# EAGLE schematic lpc1788_board (EAGLE 6.6.0)

## Sheet 1 of 4: LPC1788
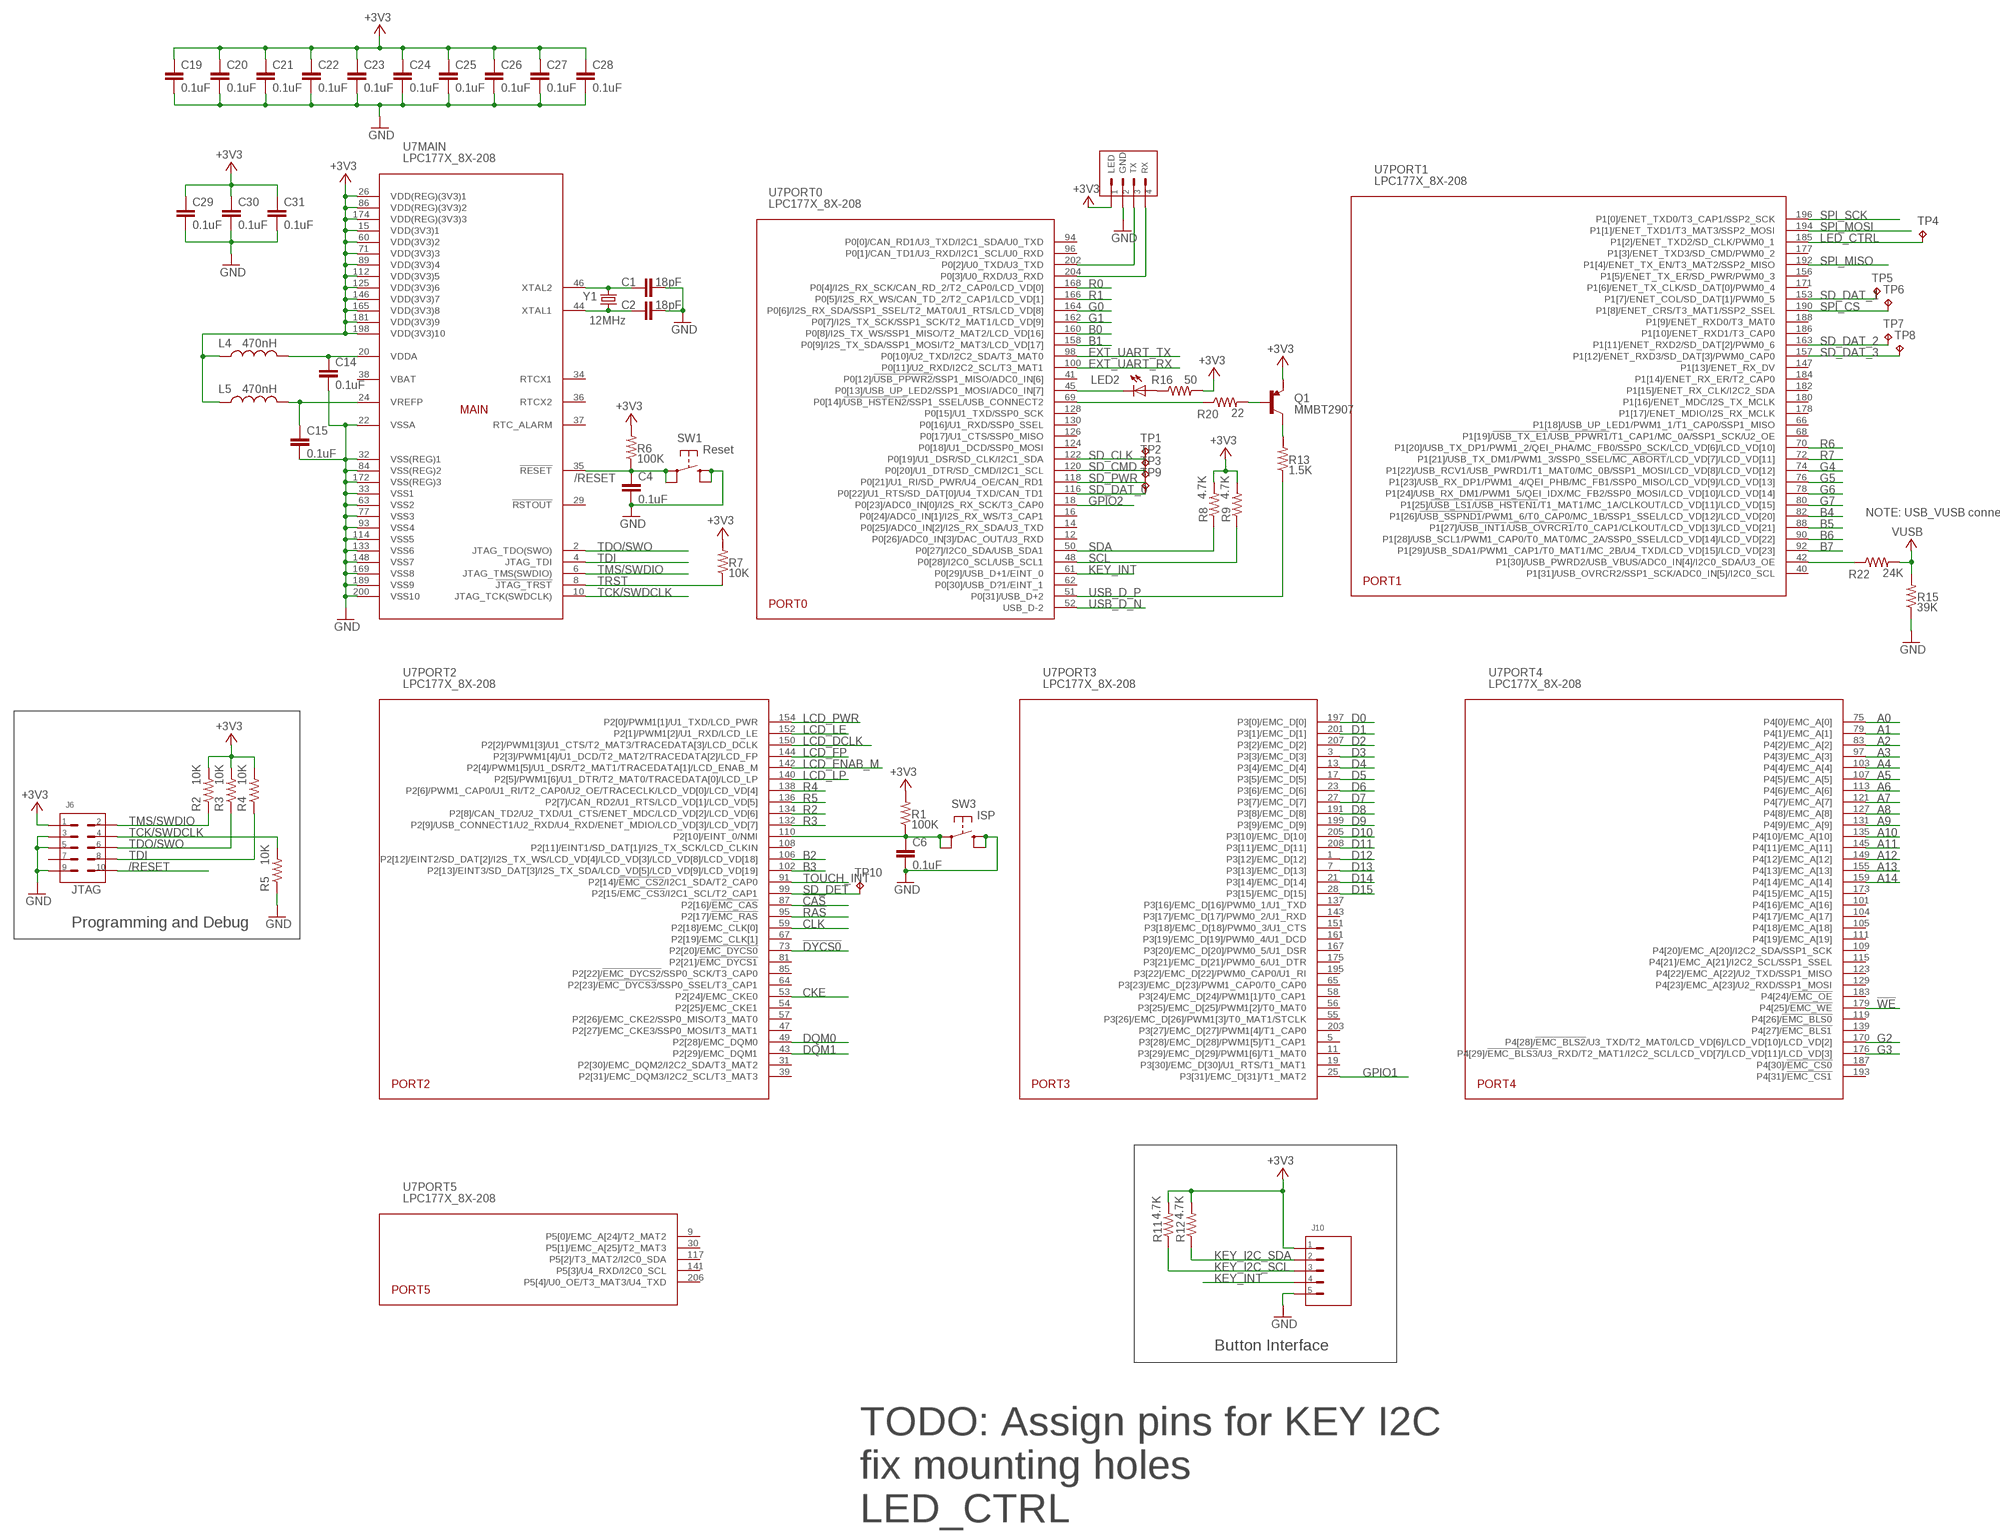
[diagram p0: schematic, sheet 1, part 1 of 2]
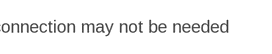
[diagram p1: schematic, sheet 1, part 2 of 2]

### Parts
C1  18pF  C-EUC0402  [C0402]
C2  18pF  C-EUC0402  [C0402]
C4  0.1uF  C-EUC0402  [C0402]
C6  0.1uF  C-EUC0402  [C0402]
C14  0.1uF  C-EUC0402  [C0402]
C15  0.1uF  C-EUC0402  [C0402]
C19  0.1uF  C-EUC0402  [C0402]
C20  0.1uF  C-EUC0402  [C0402]
C21  0.1uF  C-EUC0402  [C0402]
C22  0.1uF  C-EUC0402  [C0402]
C23  0.1uF  C-EUC0402  [C0402]
C24  0.1uF  C-EUC0402  [C0402]
C25  0.1uF  C-EUC0402  [C0402]
C26  0.1uF  C-EUC0402  [C0402]
C27  0.1uF  C-EUC0402  [C0402]
C28  0.1uF  C-EUC0402  [C0402]
C29  0.1uF  C-EUC0402  [C0402]
C30  0.1uF  C-EUC0402  [C0402]
C31  0.1uF  C-EUC0402  [C0402]
J4  Console  FLEX_SERIAL_HEADER  [4-PIN_1.25MM]
J6  JTAG  10PIN_5X2_.050IN  [10-PIN_5X2_.050IN_SMT]
J10  MOLEX_527930570_5PIN_FFC_CONNECTOR  [MOLEX_527930570]
L4  470nH  INDUCTOR_0603  [0603]
L5  470nH  INDUCTOR_0603  [0603]
LED2  USB  LEDCHIPLED_0603  [CHIPLED_0603]
Q1  MMBT2907  TRANSISTOR_PNPMMBT4403  [SOT23]
R1  100K  R-US_R0402  [R0402]
R2  10K  R-US_R0402  [R0402]
R3  10K  R-US_R0402  [R0402]
R4  10K  R-US_R0402  [R0402]
R5  10K  R-US_R0402  [R0402]
R6  100K  R-US_R0402  [R0402]
R7  10K  R-US_R0402  [R0402]
R8  4.7K  R-US_R0402  [R0402]
R9  4.7K  R-US_R0402  [R0402]
R11  4.7K  R-US_R0402  [R0402]
R12  4.7K  R-US_R0402  [R0402]
R13  1.5K  R-US_R0402  [R0402]
R15  39K  R-US_R0402  [R0402]
R16  50  R-US_R0402  [R0402]
R20  22  R-US_R0402  [R0402]
R22  24K  R-US_R0402  [R0402]
SW1  Reset  SMT_PUSHBUTTON  [SMT_PUSHBUTTON]
SW3  ISP  SMT_PUSHBUTTON  [SMT_PUSHBUTTON]
TP1  TPTP10R  [TP10R]
TP2  TPTP10R  [TP10R]
TP3  TPTP10R  [TP10R]
TP4  TPTP10R  [TP10R]
TP5  TPTP10R  [TP10R]
TP6  TPTP10R  [TP10R]
TP7  TPTP10R  [TP10R]
TP8  TPTP10R  [TP10R]
TP9  TPTP10R  [TP10R]
TP10  TPTP10R  [TP10R]
U7  LPC177X_8X-208  [LQFP208]
Y1  12MHz  XTAL_2SMD_8MMX4.5MM12MHZ  [2-SMD_8MMX4.5MM]

### Nets
!CAS: U7.87(PORT2:P2[16]/!EMC_CAS!) ; also sheet 4
!DYCS0: U7.73(PORT2:P2[20]/!EMC_DYCS0!) ; also sheet 4
!RAS: U7.95(PORT2:P2[17]/!EMC_RAS!) ; also sheet 4
!WE: U7.179(PORT4:P4[25]/!EMC_WE!) ; also sheet 4
+3V3: C19.1 C20.1 C21.1 C22.1 C23.1 C24.1 C25.1 C26.1 C27.1 C28.1 C29.1 C30.1 C31.1 J4.1(S1) J6.P$1(S1) J10.P$1(S1) L4.1 L5.1 Q1.2(E) R1.2 R2.2 R3.2 R4.2 R6.2 R7.2 R8.2 R9.2 R11.2 R12.2 R16.2 U7.15(MAIN:VDD(3V3)1) U7.26(MAIN:VDD(REG)(3V3)1) U7.60(MAIN:VDD(3V3)2) U7.71(MAIN:VDD(3V3)3) U7.86(MAIN:VDD(REG)(3V3)2) U7.89(MAIN:VDD(3V3)4) U7.112(MAIN:VDD(3V3)5) U7.125(MAIN:VDD(3V3)6) U7.146(MAIN:VDD(3V3)7) U7.165(MAIN:VDD(3V3)8) U7.174(MAIN:VDD(REG)(3V3)3) U7.181(MAIN:VDD(3V3)9) U7.198(MAIN:VDD(3V3)10) ; also sheet 2,3,4
+VUSB: R15.2 R22.2 ; supply symbol labelled VUSB ; also sheet 2
/RESET: C4.1 J6.P$10(S10) R6.1 SW1.P$1(P1) SW1.P$2(P) U7.35(MAIN:!RESET!)
/RESET1: C6.1 R1.1 SW3.P$1(P1) SW3.P$2(P) U7.110(PORT2:P2[10]/EINT_0/NMI)
A0: U7.75(PORT4:P4[0]/EMC_A[0]) ; also sheet 4
A1: U7.79(PORT4:P4[1]/EMC_A[1]) ; also sheet 4
A2: U7.83(PORT4:P4[2]/EMC_A[2]) ; also sheet 4
A3: U7.97(PORT4:P4[3]/EMC_A[3]) ; also sheet 4
A4: U7.103(PORT4:P4[4]/EMC_A[4]) ; also sheet 4
A5: U7.107(PORT4:P4[5]/EMC_A[5]) ; also sheet 4
A6: U7.113(PORT4:P4[6]/EMC_A[6]) ; also sheet 4
A7: U7.121(PORT4:P4[7]/EMC_A[7]) ; also sheet 4
A8: U7.127(PORT4:P4[8]/EMC_A[8]) ; also sheet 4
A9: U7.131(PORT4:P4[9]/EMC_A[9]) ; also sheet 4
A10: U7.135(PORT4:P4[10]/EMC_A[10]) ; also sheet 4
A11: U7.145(PORT4:P4[11]/EMC_A[11]) ; also sheet 4
A12: U7.149(PORT4:P4[12]/EMC_A[12]) ; also sheet 4
A13: U7.155(PORT4:P4[13]/EMC_A[13]) ; also sheet 4
A14: U7.159(PORT4:P4[14]/EMC_A[14]) ; also sheet 4
B0: U7.160(PORT0:P0[8]/I2S_TX_WS/SSP1_MISO/T2_MAT2/LCD_VD[16]) ; also sheet 3
B1: U7.158(PORT0:P0[9]/I2S_TX_SDA/SSP1_MOSI/T2_MAT3/LCD_VD[17]) ; also sheet 3
B2: U7.106(PORT2:P2[12]/EINT2/SD_DAT[2]/I2S_TX_WS/LCD_VD[4]/LCD_VD[3]/LCD_VD[8]/LCD_VD[18]) ; also sheet 3
B3: U7.102(PORT2:P2[13]/EINT3/SD_DAT[3]/I2S_TX_SDA/LCD_VD[5]/LCD_VD[9]/LCD_VD[19]) ; also sheet 3
B4: U7.82(PORT1:P1[26]/!USB_SSPND1!/PWM1_6/T0_CAP0/MC_1B/SSP1_SSEL/LCD_VD[12]/LCD_VD[20]) ; also sheet 3
B5: U7.88(PORT1:P1[27]/!USB_INT1!/!USB_OVRCR1!/T0_CAP1/CLKOUT/LCD_VD[13]/LCD_VD[21]) ; also sheet 3
B6: U7.90(PORT1:P1[28]/USB_SCL1/PWM1_CAP0/T0_MAT0/MC_2A/SSP0_SSEL/LCD_VD[14]/LCD_VD[22]) ; also sheet 3
B7: U7.92(PORT1:P1[29]/USB_SDA1/PWM1_CAP1/T0_MAT1/MC_2B/U4_TXD/LCD_VD[15]/LCD_VD[23]) ; also sheet 3
CKE: U7.53(PORT2:P2[24]/EMC_CKE0) ; also sheet 4
CLK: U7.59(PORT2:P2[18]/EMC_CLK[0]) ; also sheet 4
D0: U7.197(PORT3:P3[0]/EMC_D[0]) ; also sheet 4
D1: U7.201(PORT3:P3[1]/EMC_D[1]) ; also sheet 4
D2: U7.207(PORT3:P3[2]/EMC_D[2]) ; also sheet 4
D3: U7.3(PORT3:P3[3]/EMC_D[3]) ; also sheet 4
D4: U7.13(PORT3:P3[4]/EMC_D[4]) ; also sheet 4
D5: U7.17(PORT3:P3[5]/EMC_D[5]) ; also sheet 4
D6: U7.23(PORT3:P3[6]/EMC_D[6]) ; also sheet 4
D7: U7.27(PORT3:P3[7]/EMC_D[7]) ; also sheet 4
D8: U7.191(PORT3:P3[8]/EMC_D[8]) ; also sheet 4
D9: U7.199(PORT3:P3[9]/EMC_D[9]) ; also sheet 4
D10: U7.205(PORT3:P3[10]/EMC_D[10]) ; also sheet 4
D11: U7.208(PORT3:P3[11]/EMC_D[11]) ; also sheet 4
D12: U7.1(PORT3:P3[12]/EMC_D[12]) ; also sheet 4
D13: U7.7(PORT3:P3[13]/EMC_D[13]) ; also sheet 4
D14: U7.21(PORT3:P3[14]/EMC_D[14]) ; also sheet 4
D15: U7.28(PORT3:P3[15]/EMC_D[15]) ; also sheet 4
DQM0: U7.49(PORT2:P2[28]/EMC_DQM0) ; also sheet 4
DQM1: U7.43(PORT2:P2[29]/EMC_DQM1) ; also sheet 4
EXT_UART_RX: U7.100(PORT0:P0[11]/U2_RXD/I2C2_SCL/T3_MAT1)
EXT_UART_TX: U7.98(PORT0:P0[10]/U2_TXD/I2C2_SDA/T3_MAT0)
G0: U7.164(PORT0:P0[6]/I2S_RX_SDA/SSP1_SSEL/T2_MAT0/U1_RTS/LCD_VD[8]) ; also sheet 3
G1: U7.162(PORT0:P0[7]/I2S_TX_SCK/SSP1_SCK/T2_MAT1/LCD_VD[9]) ; also sheet 3
G2: U7.170(PORT4:P4[28]/!EMC_BLS2!/U3_TXD/T2_MAT0/LCD_VD[6]/LCD_VD[10]/LCD_VD[2]) ; also sheet 3
G3: U7.176(PORT4:P4[29]/!EMC_BLS3!/U3_RXD/T2_MAT1/I2C2_SCL/LCD_VD[7]/LCD_VD[11]/LCD_VD[3]) ; also sheet 3
G4: U7.74(PORT1:P1[22]/USB_RCV1/USB_PWRD1/T1_MAT0/MC_0B/SSP1_MOSI/LCD_VD[8]/LCD_VD[12]) ; also sheet 3
G5: U7.76(PORT1:P1[23]/USB_RX_DP1/PWM1_4/QEI_PHB/MC_FB1/SSP0_MISO/LCD_VD[9]/LCD_VD[13]) ; also sheet 3
G6: U7.78(PORT1:P1[24]/USB_RX_DM1/PWM1_5/QEI_IDX/MC_FB2/SSP0_MOSI/LCD_VD[10]/LCD_VD[14]) ; also sheet 3
G7: U7.80(PORT1:P1[25]/!USB_LS1!/!USB_HSTEN1!/T1_MAT1/MC_1A/CLKOUT/LCD_VD[11]/LCD_VD[15]) ; also sheet 3
GND: C1.2 C2.2 C4.2 C6.2 C14.2 C15.2 C19.2 C20.2 C21.2 C22.2 C23.2 C24.2 C25.2 C26.2 C27.2 C28.2 C29.2 C30.2 C31.2 J4.2(S2) J6.P$3(S3) J6.P$5(S5) J6.P$9(S9) J10.P$5(S5) R5.1 R15.1 SW1.P$3(S1) SW1.P$4(S) SW3.P$3(S1) SW3.P$4(S) U7.22(MAIN:VSSA) U7.32(MAIN:VSS(REG)1) U7.33(MAIN:VSS1) U7.63(MAIN:VSS2) U7.77(MAIN:VSS3) U7.84(MAIN:VSS(REG)2) U7.93(MAIN:VSS4) U7.114(MAIN:VSS5) U7.133(MAIN:VSS6) U7.148(MAIN:VSS7) U7.169(MAIN:VSS8) U7.172(MAIN:VSS(REG)3) U7.189(MAIN:VSS9) U7.200(MAIN:VSS10) ; also sheet 2,3,4
GPIO1: U7.25(PORT3:P3[31]/EMC_D[31]/T1_MAT2)
GPIO2: U7.18(PORT0:P0[23]/ADC0_IN[0]/I2S_RX_SCK/T3_CAP0)
KEY_I2C_SCL: J10.P$3(S3) R11.1
KEY_I2C_SDA: J10.P$2(S2) R12.1
KEY_INT: J10.P$4(S4) U7.61(PORT0:P0[29]/USB_D+1/EINT_0)
LCD_DCLK: U7.150(PORT2:P2[2]/PWM1[3]/U1_CTS/T2_MAT3/TRACEDATA[3]/LCD_DCLK) ; also sheet 3
LCD_ENAB_M: U7.142(PORT2:P2[4]/PWM1[5]/U1_DSR/T2_MAT1/TRACEDATA[1]/LCD_ENAB_M) ; also sheet 3
LCD_FP: U7.144(PORT2:P2[3]/PWM1[4]/U1_DCD/T2_MAT2/TRACEDATA[2]/LCD_FP) ; also sheet 3
LCD_LE: U7.152(PORT2:P2[1]/PWM1[2]/U1_RXD/LCD_LE) ; also sheet 3
LCD_LP: U7.140(PORT2:P2[5]/PWM1[6]/U1_DTR/T2_MAT0/TRACEDATA[0]/LCD_LP) ; also sheet 3
LCD_PWR: U7.154(PORT2:P2[0]/PWM1[1]/U1_TXD/LCD_PWR) ; also sheet 3
LED_CTRL: TP4.TP U7.185(PORT1:P1[2]/ENET_TXD2/SD_CLK/PWM0_1) ; also sheet 2
N$15: C1.1 U7.46(MAIN:XTAL2) Y1.2
N$16: C2.1 U7.44(MAIN:XTAL1) Y1.1
N$17: C14.1 L4.2 U7.20(MAIN:VDDA)
N$18: C15.1 L5.2 U7.24(MAIN:VREFP)
N$21: Q1.3(C) R13.2
N$22: R20.1 U7.69(PORT0:P0[14]/!USB_HSTEN2!/SSP1_SSEL/USB_CONNECT2)
N$23: LED2.A R16.1
N$24: LED2.C U7.45(PORT0:P0[13]/USB_UP_LED2/SSP1_MOSI/ADC0_IN[7])
N$25: J4.3(S3) U7.202(PORT0:P0[2]/U0_TXD/U3_TXD)
N$26: J4.4(S4) U7.204(PORT0:P0[3]/U0_RXD/U3_RXD)
N$29: Q1.1(B) R20.2
N$42: R22.1 U7.42(PORT1:P1[30]/USB_PWRD2/USB_VBUS/ADC0_IN[4]/I2C0_SDA/U3_OE)
R0: U7.168(PORT0:P0[4]/I2S_RX_SCK/CAN_RD_2/T2_CAP0/LCD_VD[0]) ; also sheet 3
R1: U7.166(PORT0:P0[5]/I2S_RX_WS/CAN_TD_2/T2_CAP1/LCD_VD[1]) ; also sheet 3
R2: U7.134(PORT2:P2[8]/CAN_TD2/U2_TXD/U1_CTS/ENET_MDC/LCD_VD[2]/LCD_VD[6]) ; also sheet 3
R3: U7.132(PORT2:P2[9]/USB_CONNECT1/U2_RXD/U4_RXD/ENET_MDIO/LCD_VD[3]/LCD_VD[7]) ; also sheet 3
R4: U7.138(PORT2:P2[6]/PWM1_CAP0/U1_RI/T2_CAP0/U2_OE/TRACECLK/LCD_VD[0]/LCD_VD[4]) ; also sheet 3
R5: U7.136(PORT2:P2[7]/CAN_RD2/U1_RTS/LCD_VD[1]/LCD_VD[5]) ; also sheet 3
R6: U7.70(PORT1:P1[20]/USB_TX_DP1/PWM1_2/QEI_PHA/MC_FB0/SSP0_SCK/LCD_VD[6]/LCD_VD[10]) ; also sheet 3
R7: U7.72(PORT1:P1[21]/USB_TX_DM1/PWM1_3/SSP0_SSEL/!MC_ABORT!/LCD_VD[7]/LCD_VD[11]) ; also sheet 3
SCL: R9.1 U7.48(PORT0:P0[28]/I2C0_SCL/USB_SCL1) ; also sheet 3
SD_CLK: TP1.TP U7.122(PORT0:P0[19]/U1_DSR/SD_CLK/I2C1_SDA) ; also sheet 4
SD_CMD: TP2.TP U7.120(PORT0:P0[20]/U1_DTR/SD_CMD/I2C1_SCL) ; also sheet 4
SD_DAT_0: TP9.TP U7.116(PORT0:P0[22]/U1_RTS/SD_DAT[0]/U4_TXD/CAN_TD1) ; also sheet 4
SD_DAT_1: TP5.TP U7.153(PORT1:P1[7]/ENET_COL/SD_DAT[1]/PWM0_5) ; also sheet 4
SD_DAT_2: TP7.TP U7.163(PORT1:P1[11]/ENET_RXD2/SD_DAT[2]/PWM0_6) ; also sheet 4
SD_DAT_3: TP8.TP U7.157(PORT1:P1[12]/ENET_RXD3/SD_DAT[3]/PWM0_CAP0) ; also sheet 4
SD_DET: U7.99(PORT2:P2[15/!EMC_CS3!/I2C1_SCL/T2_CAP1) ; also sheet 4
SD_PWR: TP3.TP U7.118(PORT0:P0[21]/U1_RI/SD_PWR/U4_OE/CAN_RD1) ; also sheet 4
SDA: R8.1 U7.50(PORT0:P0[27]/I2C0_SDA/USB_SDA1) ; also sheet 3
SPI_CS: TP6.TP U7.190(PORT1:P1[8]/ENET_CRS/T3_MAT1/SSP2_SSEL)
SPI_MISO: U7.192(PORT1:P1[4]/ENET_TX_EN/T3_MAT2/SSP2_MISO)
SPI_MOSI: U7.194(PORT1:P1[1]/ENET_TXD1/T3_MAT3/SSP2_MOSI)
SPI_SCK: U7.196(PORT1:P1[0]/ENET_TXD0/T3_CAP1/SSP2_SCK)
TCK/SWDCLK: J6.P$4(S4) R5.2 U7.10(MAIN:JTAG_TCK(SWDCLK))
TDI: J6.P$8(S8) R4.1 U7.4(MAIN:JTAG_TDI)
TDO/SWO: J6.P$6(S6) R3.1 U7.2(MAIN:JTAG_TDO(SWO))
TMS/SWDIO: J6.P$2(S2) R2.1 U7.6(MAIN:JTAG_TMS(SWDIO))
TOUCH_INT: U7.91(PORT2:P2[14]/!EMC_CS2!/I2C1_SDA/T2_CAP0) ; also sheet 3
TRST: R7.1 U7.8(MAIN:!JTAG_TRST!)
USB_D_N: U7.52(PORT0:USB_D-2) ; also sheet 2
USB_D_P: R13.1 U7.51(PORT0:P0[31]/USB_D+2) ; also sheet 2
Unconnected: J6.P$7(S7) TP10.TP U7.5(PORT3:P3[28]/EMC_D[28]/PWM1[5]/T1_CAP1) U7.9(PORT5:P5[0]/EMC_A[24]/T2_MAT2) U7.11(PORT3:P3[29]/EMC_D[29]/PWM1[6]/T1_MAT0) U7.12(PORT0:P0[26]/ADC0_IN[3]/DAC_OUT/U3_RXD) U7.14(PORT0:P0[25]/ADC0_IN[2]/I2S_RX_SDA/U3_TXD) U7.16(PORT0:P0[24]/ADC0_IN[1]/I2S_RX_WS/T3_CAP1) U7.19(PORT3:P3[30]/EMC_D[30]/U1_RTS/T1_MAT1) U7.29(MAIN:!RSTOUT!) U7.30(PORT5:P5[1]/EMC_A[25]/T2_MAT3) U7.31(PORT2:P2[30]/EMC_DQM2/I2C2_SDA/T3_MAT2) U7.34(MAIN:RTCX1) U7.36(MAIN:RTCX2) U7.37(MAIN:RTC_ALARM) U7.38(MAIN:VBAT) U7.39(PORT2:P2[31]/EMC_DQM3/I2C2_SCL/T3_MAT3) U7.40(PORT1:P1[31]/USB_OVRCR2/SSP1_SCK/ADC0_IN[5]/I2C0_SCL) U7.41(PORT0:P0[12]/!USB_PPWR2!/SSP1_MISO/ADC0_IN[6]) U7.47(PORT2:P2[27]/EMC_CKE3/SSP0_MOSI/T3_MAT1) U7.54(PORT2:P2[25]/EMC_CKE1) U7.55(PORT3:P3[26]/EMC_D[26]/PWM1[3]/T0_MAT1/STCLK) U7.56(PORT3:P3[25]/EMC_D[25]/PWM1[2]/T0_MAT0) U7.57(PORT2:P2[26]/EMC_CKE2/SSP0_MISO/T3_MAT0) U7.58(PORT3:P3[24]/EMC_D[24]/PWM1[1]/T0_CAP1) U7.62(PORT0:P0[30]/USB_D?1/EINT_1) U7.64(PORT2:P2[23]/!EMC_DYCS3!/SSP0_SSEL/T3_CAP1) U7.65(PORT3:P3[23]/EMC_D[23]/PWM1_CAP0/T0_CAP0) U7.66(PORT1:P1[18]/USB_UP_LED1/PWM1_1/T1_CAP0/SSP1_MISO) U7.67(PORT2:P2[19]/EMC_CLK[1]) U7.68(PORT1:P1[19]/!USB_TX_E1!/!USB_PPWR1!/T1_CAP1/MC_0A/SSP1_SCK/U2_OE) U7.81(PORT2:P2[21]/!EMC_DYCS1!) U7.85(PORT2:P2[22]/!EMC_DYCS2!/SSP0_SCK/T3_CAP0) U7.94(PORT0:P0[0]/CAN_RD1/U3_TXD/I2C1_SDA/U0_TXD) U7.96(PORT0:P0[1]/CAN_TD1/U3_RXD/I2C1_SCL/U0_RXD) U7.101(PORT4:P4[16]/EMC_A[16]) U7.104(PORT4:P4[17]/EMC_A[17]) U7.105(PORT4:P4[18]/EMC_A[18]) U7.108(PORT2:P2[11]/EINT1/SD_DAT[1]/I2S_TX_SCK/LCD_CLKIN) U7.109(PORT4:P4[20]/EMC_A[20]/I2C2_SDA/SSP1_SCK) U7.111(PORT4:P4[19]/EMC_A[19]) U7.115(PORT4:P4[21]/EMC_A[21]/I2C2_SCL/SSP1_SSEL) U7.117(PORT5:P5[2]/T3_MAT2/I2C0_SDA) U7.119(PORT4:P4[26]/!EMC_BLS0!) U7.123(PORT4:P4[22]/EMC_A[22]/U2_TXD/SSP1_MISO) U7.124(PORT0:P0[18]/U1_DCD/SSP0_MOSI) U7.126(PORT0:P0[17]/U1_CTS/SSP0_MISO) U7.128(PORT0:P0[15]/U1_TXD/SSP0_SCK) U7.129(PORT4:P4[23]/EMC_A[23]/U2_RXD/SSP1_MOSI) U7.130(PORT0:P0[16]/U1_RXD/SSP0_SSEL) U7.137(PORT3:P3[16]/EMC_D[16]/PWM0_1/U1_TXD) U7.139(PORT4:P4[27]/!EMC_BLS1!) U7.141(PORT5:P5[3]/U4_RXD/I2C0_SCL) U7.143(PORT3:P3[17]/EMC_D[17]/PWM0_2/U1_RXD) U7.147(PORT1:P1[13]/ENET_RX_DV) U7.151(PORT3:P3[18]/EMC_D[18]/PWM0_3/U1_CTS) U7.156(PORT1:P1[5]/ENET_TX_ER/SD_PWR/PWM0_3) U7.161(PORT3:P3[19]/EMC_D[19]/PWM0_4/U1_DCD) U7.167(PORT3:P3[20]/EMC_D[20]/PWM0_5/U1_DSR) U7.171(PORT1:P1[6]/ENET_TX_CLK/SD_DAT[0]/PWM0_4) U7.173(PORT4:P4[15]/EMC_A[15]) U7.175(PORT3:P3[21]/EMC_D[21]/PWM0_6/U1_DTR) U7.177(PORT1:P1[3]/ENET_TXD3/SD_CMD/PWM0_2) U7.178(PORT1:P1[17]/ENET_MDIO/I2S_RX_MCLK) U7.180(PORT1:P1[16]/ENET_MDC/I2S_TX_MCLK) U7.182(PORT1:P1[15]/ENET_RX_CLK/I2C2_SDA) U7.183(PORT4:P4[24]/!EMC_OE!) U7.184(PORT1:P1[14]/ENET_RX_ER/T2_CAP0) U7.186(PORT1:P1[10]/ENET_RXD1/T3_CAP0) U7.187(PORT4:P4[30]/!EMC_CS0!) U7.188(PORT1:P1[9]/ENET_RXD0/T3_MAT0) U7.193(PORT4:P4[31]/!EMC_CS1!) U7.195(PORT3:P3[22]/EMC_D[22]/PWM0_CAP0/U1_RI) U7.203(PORT3:P3[27]/EMC_D[27]/PWM1[4]/T1_CAP0) U7.206(PORT5:P5[4]/U0_OE/T3_MAT3/U4_TXD)

### Notes on the sheet
- NOTE: USB_VUSB connection may not be needed
- JTAG
- Programming and Debug
- Button Interface
- TODO: Assign pins for KEY I2C
  fix mounting holes
  LED_CTRL

## Sheet 2 of 4: Power
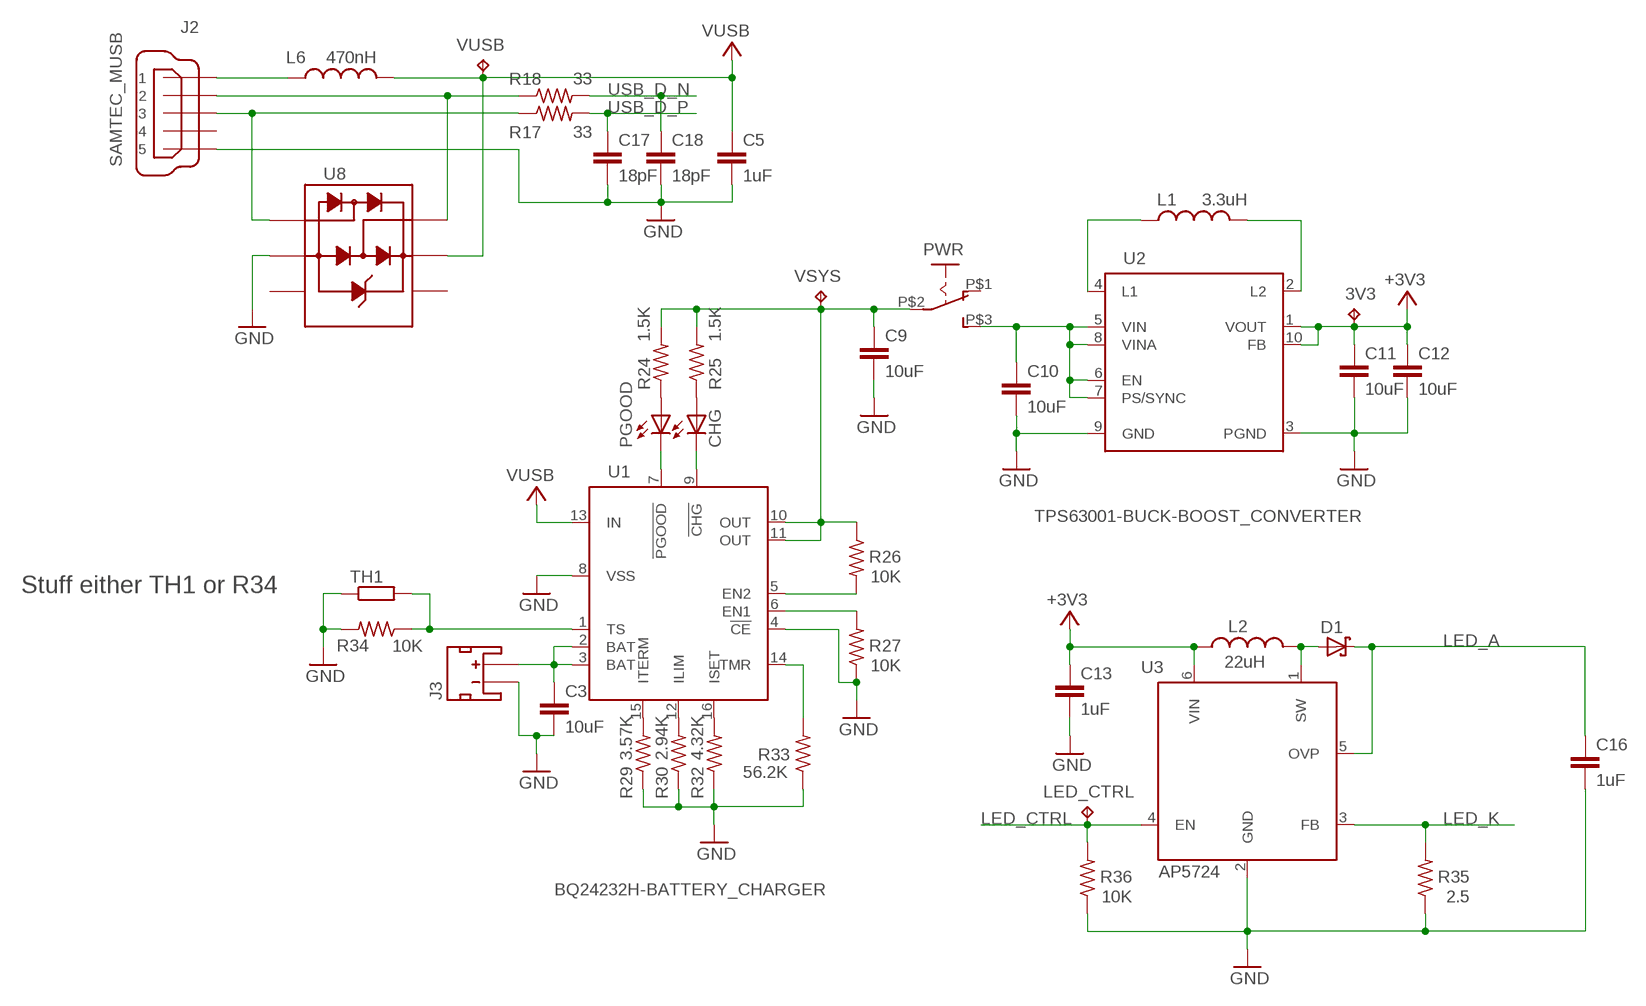
[diagram p2: schematic, sheet 2]

### Parts
3V3  TPTP10R  [TP10R]
C3  10uF  C-EUC0805K  [C0805K]
C5  1uF  C-EUC0402  [C0402]
C9  10uF  C-EUC0805K  [C0805K]
C10  10uF  C-EUC0805K  [C0805K]
C11  10uF  C-EUC0805K  [C0805K]
C12  10uF  C-EUC0805K  [C0805K]
C13  1uF  C-EUC0402  [C0402]
C16  1uF  C-EUC0402  [C0402]
C17  18pF  C-EUC0402  [C0402]
C18  18pF  C-EUC0402  [C0402]
CHG  USB  LEDCHIPLED_0603  [CHIPLED_0603]
D1  B0540WS-SCHOTTKY_DIODE  [SOD-323]
J2  SAMTEC_MUSB  [MUSB-05-X-B-SM-A]
J3  JST_2MM_SMT  [JST_2MM_SMT]
L1  3.3uH  NR3015T3R3M-INDUCTOR  [3015]
L2  22uH  NR4012T220M  [4012]
L6  470nH  INDUCTOR_0603  [0603]
LED_CTRL  TPTP10R  [TP10R]
PGOOD  USB  LEDCHIPLED_0603  [CHIPLED_0603]
PWR  OS102011MA1QS1  [OS102011MA1QS1]
R17  33  R-US_R0402  [R0402]
R18  33  R-US_R0402  [R0402]
R24  1.5K  R-US_R0402  [R0402]
R25  1.5K  R-US_R0402  [R0402]
R26  10K  R-US_R0402  [R0402]
R27  10K  R-US_R0402  [R0402]
R29  3.57K  R-US_R0402  [R0402]
R30  2.94K  R-US_R0402  [R0402]
R32  4.32K  R-US_R0402  [R0402]
R33  56.2K  R-US_R0402  [R0402]
R34  10K  R-US_R0402  [R0402]
R35  2.5  R-US_R0402  [R0402]
R36  10K  R-US_R0402  [R0402]
TH1  R-EU_0204/2V  [0204V]
U1  BQ24232H-BATTERY_CHARGER  [QFN-16]
U2  TPS63001-BUCK-BOOST_CONVERTER  [QFN-10]
U3  AP5724  [SOT-26]
U8  NUP2202  [SC-88]
VSYS  TPTP10R  [TP10R]
VUSB  TPTP10R  [TP10R]

### Nets
+3V3: 3V3.TP C11.1 C12.1 C13.1 L2.1 U2.1(VOUT) U2.10(FB) U3.6(VIN) ; also sheet 1,3,4
+VUSB: C5.1 L6.2 U1.13(IN) U8.P$5 VUSB.TP ; supply symbol labelled VUSB ; also sheet 1
D_N: J2.2 R18.1 U8.P$6
D_P: J2.3 R17.1 U8.P$1
GND: C3.2 C5.2 C9.2 C10.2 C11.2 C12.2 C13.2 C16.2 C17.2 C18.2 J2.5 J3.1(-) R27.1 R29.1 R30.1 R32.1 R33.1 R34.2 R35.1 R36.1 TH1.1 U1.4(!CE) U1.8(VSS) U2.3(PGND) U2.9(GND) U3.2(GND) U8.P$2 ; also sheet 1,3,4
LED_A: C16.1 D1.C U3.5(OVP) ; also sheet 3
LED_CTRL: LED_CTRL.TP R36.2 U3.4(EN) ; also sheet 1
LED_K: R35.2 U3.3(FB) ; also sheet 3
N$2: C9.1 PWR.P$2(P) R24.2 R25.2 R26.1 U1.10(OUT) U1.11(OUT) VSYS.TP
N$3: R26.2 U1.5(EN2)
N$4: R27.2 U1.6(EN1)
N$5: PGOOD.A R24.1
N$6: CHG.A R25.1
N$7: PGOOD.C U1.7(!PGOOD)
N$8: CHG.C U1.9(!CHG)
N$9: C3.1 J3.2(+) U1.2(BAT) U1.3(BAT)
N$10: R34.1 TH1.2 U1.1(TS)
N$11: R29.2 U1.15(ITERM)
N$12: R30.2 U1.12(ILIM)
N$13: R32.2 U1.16(ISET)
N$14: C10.1 PWR.P$3(S) U2.5(VIN) U2.6(EN) U2.7(PS/SYNC) U2.8(VINA)
N$19: R33.2 U1.14(TMR)
N$30: L1.1 U2.4(L1)
N$31: L1.2 U2.2(L2)
N$33: D1.A L2.2 U3.1(SW)
N$43: J2.1 L6.1
USB_D_N: C18.1 R18.2 ; also sheet 1
USB_D_P: C17.1 R17.2 ; also sheet 1
Unconnected: J2.4 PWR.P$1(O) U8.P$3 U8.P$4

### Notes on the sheet
- Stuff either TH1 or R34

## Sheet 3 of 4: LCD
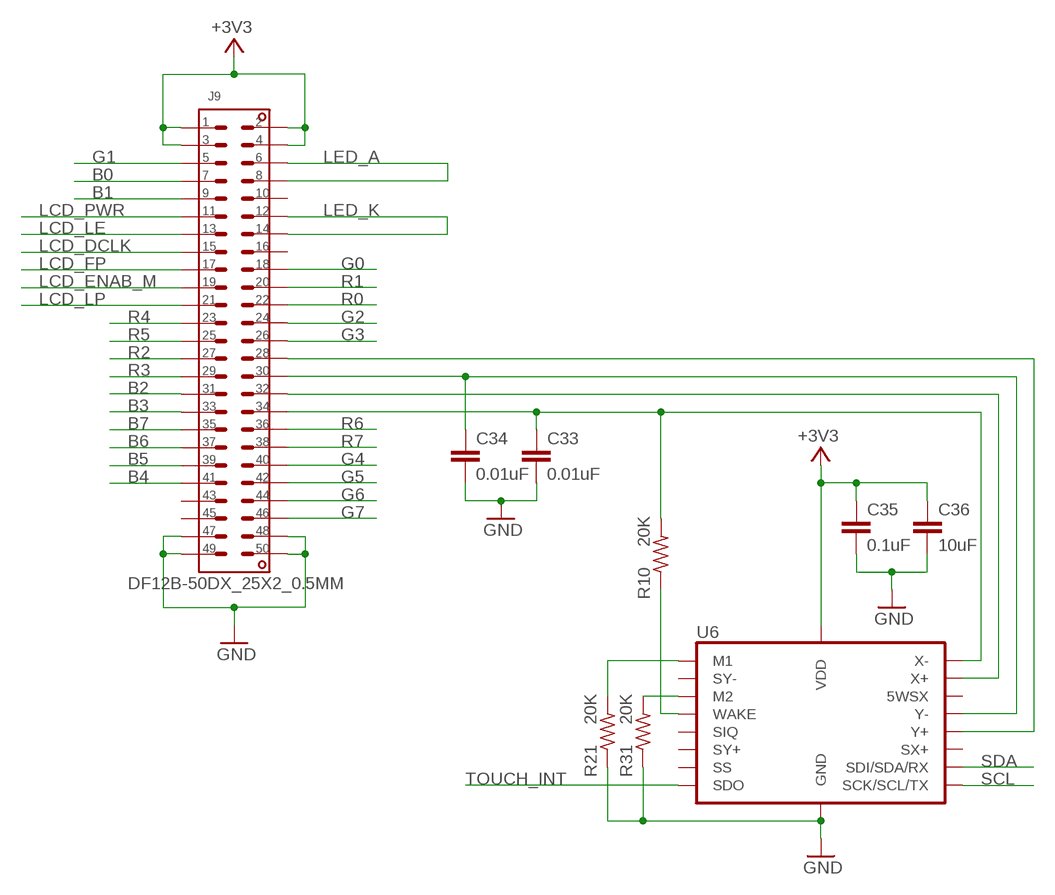
[diagram p3: schematic, sheet 3]

### Parts
C33  0.01uF  C-EUC0402  [C0402]
C34  0.01uF  C-EUC0402  [C0402]
C35  0.1uF  C-EUC0402  [C0402]
C36  10uF  C-EUC0402  [C0402]
J9  DF12B-50DX_25X2_0.5MM  [DF12B-50DX_25X2_0.5MM]
R10  20K  R-US_R0402  [R0402]
R21  20K  R-US_R0402  [R0402]
R31  20K  R-US_R0402  [R0402]
U6  AR1021-RESISTIVE_TOUCH_CONTROLLER  [SSOP-20]

### Nets
+3V3: C35.1 C36.1 J9.P$1(S1) J9.P$2(S2) J9.P$3(S3) J9.P$4(S4) U6.P$1(VDD) ; also sheet 1,2,4
B0: J9.P$7(S7) ; also sheet 1
B1: J9.P$9(S9) ; also sheet 1
B2: J9.P$31(S31) ; also sheet 1
B3: J9.P$33(S33) ; also sheet 1
B4: J9.P$41(S41) ; also sheet 1
B5: J9.P$39(S39) ; also sheet 1
B6: J9.P$37(S37) ; also sheet 1
B7: J9.P$35(S35) ; also sheet 1
G0: J9.P$18(S18) ; also sheet 1
G1: J9.P$5(S5) ; also sheet 1
G2: J9.P$24(S24) ; also sheet 1
G3: J9.P$26(S26) ; also sheet 1
G4: J9.P$40(S40) ; also sheet 1
G5: J9.P$42(S42) ; also sheet 1
G6: J9.P$44(S44) ; also sheet 1
G7: J9.P$46(S46) ; also sheet 1
GND: C33.2 C34.2 C35.2 C36.2 J9.P$47(S47) J9.P$48(S48) J9.P$49(S49) J9.P$50(S50) R21.1 R31.1 U6.P$20(GND) ; also sheet 1,2,4
LCD_DCLK: J9.P$15(S15) ; also sheet 1
LCD_ENAB_M: J9.P$19(S19) ; also sheet 1
LCD_FP: J9.P$17(S17) ; also sheet 1
LCD_LE: J9.P$13(S13) ; also sheet 1
LCD_LP: J9.P$21(S21) ; also sheet 1
LCD_PWR: J9.P$11(S11) ; also sheet 1
LED_A: J9.P$6(S6) J9.P$8(S8) ; also sheet 2
LED_K: J9.P$12(S12) J9.P$14(S14) ; also sheet 2
N$35: C33.1 J9.P$34(S34) R10.2 U6.P$19(X-)
N$36: J9.P$32(S32) U6.P$18(X+)
N$37: C34.1 J9.P$30(S30) U6.P$16(Y-)
N$38: J9.P$28(S28) U6.P$15(Y+)
N$39: R21.2 U6.P$2(M1)
N$40: R10.1 U6.P$5(WAKE)
N$41: R31.2 U6.P$4(M2)
R0: J9.P$22(S22) ; also sheet 1
R1: J9.P$20(S20) ; also sheet 1
R2: J9.P$27(S27) ; also sheet 1
R3: J9.P$29(S29) ; also sheet 1
R4: J9.P$23(S23) ; also sheet 1
R5: J9.P$25(S25) ; also sheet 1
R6: J9.P$36(S36) ; also sheet 1
R7: J9.P$38(S38) ; also sheet 1
SCL: U6.P$11(SCK/SCL/TX) ; also sheet 1
SDA: U6.P$13(SDI/SDA/RX) ; also sheet 1
TOUCH_INT: U6.P$9(SDO) ; also sheet 1
Unconnected: J9.P$10(S10) J9.P$16(S16) J9.P$43(S43) J9.P$45(S45) U6.P$3(SY-) U6.P$6(SIQ) U6.P$7(SY+) U6.P$8(SS) U6.P$14(SX+) U6.P$17(5WSX)

## Sheet 4 of 4: Memory
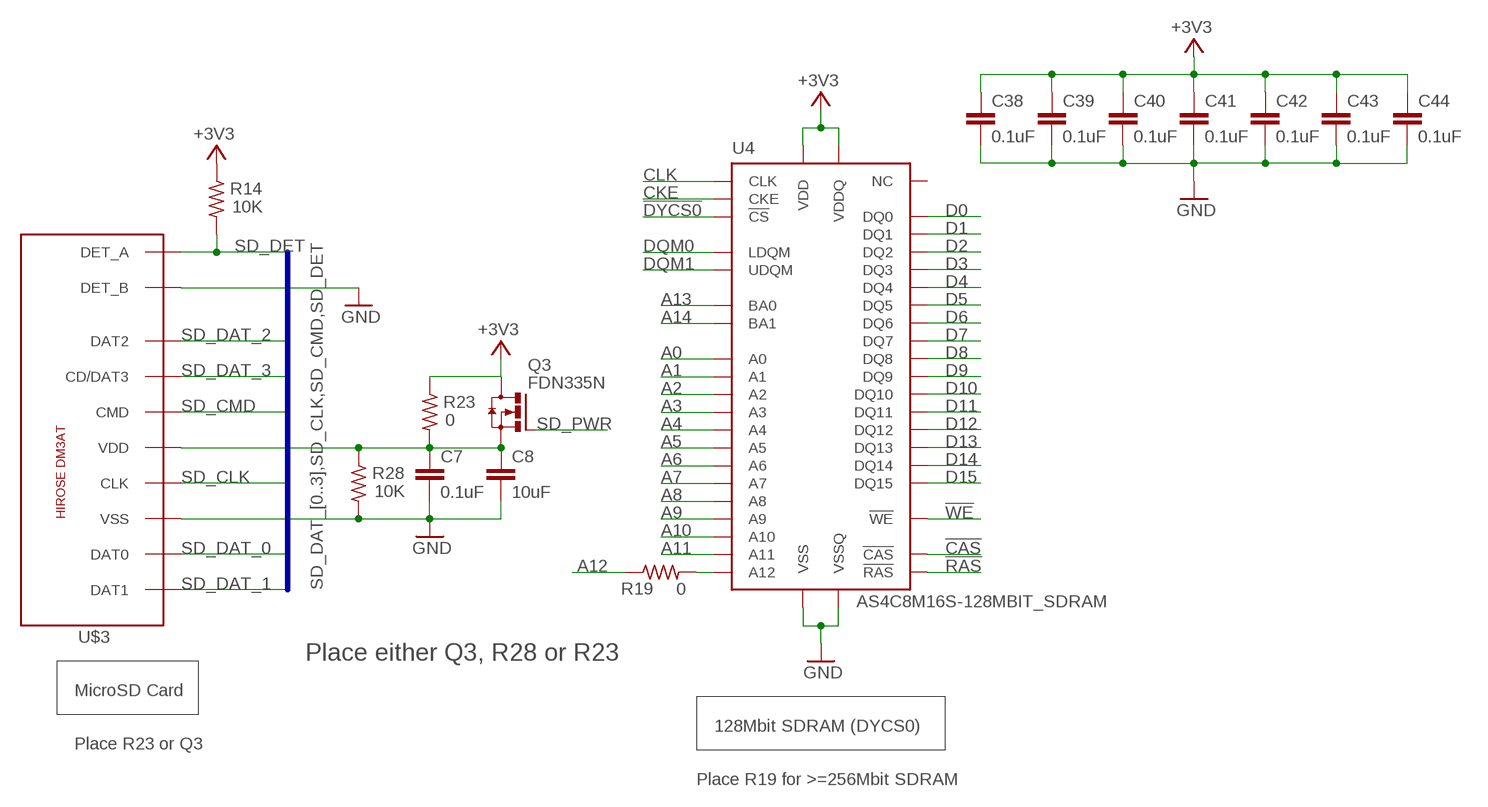
[diagram p4: schematic, sheet 4]

### Parts
C7  0.1uF  C-EUC0402  [C0402]
C8  10uF  C-EUC0805K  [C0805K]
C38  0.1uF  C-EUC0402  [C0402]
C39  0.1uF  C-EUC0402  [C0402]
C40  0.1uF  C-EUC0402  [C0402]
C41  0.1uF  C-EUC0402  [C0402]
C42  0.1uF  C-EUC0402  [C0402]
C43  0.1uF  C-EUC0402  [C0402]
C44  0.1uF  C-EUC0402  [C0402]
Q3  FDN335N  [SUPER-SOT3]
R14  10K  R-US_R0402  [R0402]
R19  0  R-US_R0402  [R0402]
R23  0  R-US_R0402  [R0402]
R28  10K  R-US_R0402  [R0402]
U4  AS4C8M16S-128MBIT_SDRAM  [TSOP54-II]
U$3  DM3AT  [DM3AT]

### Nets
!CAS: U4.P$17(!CAS) ; also sheet 1
!DYCS0: U4.P$19(!CS) ; also sheet 1
!RAS: U4.P$18(!RAS) ; also sheet 1
!WE: U4.P$16(!WE) ; also sheet 1
+3V3: C38.1 C39.1 C40.1 C41.1 C42.1 C43.1 C44.1 Q3.3(D) R14.1 R23.1 U4.P$1(VDD) U4.P$3(VDDQ) U4.P$9(VDDQ) U4.P$14(VDD) U4.P$27(VDD) U4.P$43(VDDQ) U4.P$49(VDDQ) ; also sheet 1,2,3
A0: U4.P$23(A0) ; also sheet 1
A1: U4.P$24(A1) ; also sheet 1
A2: U4.P$25(A2) ; also sheet 1
A3: U4.P$26(A3) ; also sheet 1
A4: U4.P$29(A4) ; also sheet 1
A5: U4.P$30(A5) ; also sheet 1
A6: U4.P$31(A6) ; also sheet 1
A7: U4.P$32(A7) ; also sheet 1
A8: U4.P$33(A8) ; also sheet 1
A9: U4.P$34(A9) ; also sheet 1
A10: U4.P$22(A10) ; also sheet 1
A11: U4.P$35(A11) ; also sheet 1
A12: R19.1 ; also sheet 1
A13: U4.P$20(BA0) ; also sheet 1
A14: U4.P$21(BA1) ; also sheet 1
CKE: U4.P$37(CKE) ; also sheet 1
CLK: U4.P$38(CLK) ; also sheet 1
D0: U4.P$2(DQ0) ; also sheet 1
D1: U4.P$4(DQ1) ; also sheet 1
D2: U4.P$5(DQ2) ; also sheet 1
D3: U4.P$7(DQ3) ; also sheet 1
D4: U4.P$8(DQ4) ; also sheet 1
D5: U4.P$10(DQ5) ; also sheet 1
D6: U4.P$11(DQ6) ; also sheet 1
D7: U4.P$13(DQ7) ; also sheet 1
D8: U4.P$42(DQ8) ; also sheet 1
D9: U4.P$44(DQ9) ; also sheet 1
D10: U4.P$45(DQ10) ; also sheet 1
D11: U4.P$47(DQ11) ; also sheet 1
D12: U4.P$48(DQ12) ; also sheet 1
D13: U4.P$50(DQ13) ; also sheet 1
D14: U4.P$51(DQ14) ; also sheet 1
D15: U4.P$53(DQ15) ; also sheet 1
DQM0: U4.P$15(LDQM) ; also sheet 1
DQM1: U4.P$39(UDQM) ; also sheet 1
GND: C7.2 C8.2 C38.2 C39.2 C40.2 C41.2 C42.2 C43.2 C44.2 R28.2 U4.P$6(VSSQ) U4.P$12(VSSQ) U4.P$28(VSS) U4.P$41(VSS) U4.P$46(VSSQ) U4.P$52(VSSQ) U4.P$54(VSS) U$3.DET_B U$3.VSS ; also sheet 1,2,3
N$1: C7.1 C8.1 Q3.2(S) R23.2 R28.1 U$3.VDD
N$28: R19.2 U4.P$36(A12)
SD_CLK: U$3.CLK ; also sheet 1
SD_CMD: U$3.CMD ; also sheet 1
SD_DAT_0: U$3.DAT0 ; also sheet 1
SD_DAT_1: U$3.DAT1 ; also sheet 1
SD_DAT_2: U$3.DAT2 ; also sheet 1
SD_DAT_3: U$3.CD/DAT3 ; also sheet 1
SD_DET: R14.2 U$3.DET_A ; also sheet 1
SD_PWR: Q3.1(G) ; also sheet 1
Unconnected: U4.P$40(NC)

### Buses
SD_DAT_[0..3],SD_CLK,SD_CMD,SD_DET

### Notes on the sheet
- Place either Q3, R28 or R23
- MicroSD Card
- 128Mbit SDRAM (DYCS0)
- Place R23 or Q3
- Place R19 for >=256Mbit SDRAM

## Library data of the parts
3V3 LED_CTRL TP1-TP10 VSYS VUSB = testpad:TP: Test pad
C1-C31 C33-C36 C38-C44 = rcl:C-EU: CAPACITOR, European symbol
CHG LED2 PGOOD = led:LED: LED OSRAM: - CHIPLED LG R971, LG N971, LY N971, LG Q971, LY Q971, LO R971, LY R971 LH N974, LH R974 LS Q976, LO Q976, LY Q976 LO Q996 - Hyper CHIPLED LW Q18S LB Q993, LB Q99A, LB R99A - SideLED LS A670, LO A670, LY A670, LG A670, LP A670 LB A673, LV A673, LT A673, LW A673 LH A674 LY A675 LS A676, LA A676, LO A676, LY A676, LW A676 LS A679, LY A679, LG A679 - Hyper Micro SIDELED® LS Y876, LA Y876, LO Y876, LY Y876 LT Y87S - SmartLED LW L88C, LW L88S LB L89C, LB L89S, LG L890 LS L89K, LO L89K, LY L89K LS L896, LA L896, LO L896, LY L896 - TOPLED LS T670, LO T670, LY T670, LG T670, LP T670 LSG T670, LSP T670, LSY T670, LOP T670, LYG T670 LG T671, LOG T671, LSG T671 LB T673, LV T673, LT T673, LW T673 LH T674 LS T676, LA T676, LO T676, LY T676, LB T676, LH T676, LSB T676, LW T676 LB T67C, LV T67C, LT T67C, LS T67K, LO T67K, LY T67K, LW E67C LS E67B, LA E67B, LO E67B, LY E67B, LB E67C, LV E67C, LT E67C LW T67C LS T679, LY T679, LG T679 LS T770, LO T770, LY T770, LG T770, LP T770 LB T773, LV T773, LT T773, LW T773 LH T774 LS E675, LA E675, LY E675, LS T675 LS T776, LA T776, LO T776, LY T776, LB T776 LHGB T686 LT T68C, LB T68C - Hyper Mini TOPLED® LB M676 - Mini TOPLED Santana® LG M470 LS M47K, LO M47K, LY M47K Source: http://www.osram.convergy.de LUXEON: - LUMILED® LXK2-PW12-R00, LXK2-PW12-S00, LXK2-PW14-U00, LXK2-PW14-V00 LXK2-PM12-R00, LXK2-PM12-S00, LXK2-PM14-U00 LXK2-PE12-Q00, LXK2-PE12-R00, LXK2-PE12-S00, LXK2-PE14-T00, LXK2-PE14-U00 LXK2-PB12-K00, LXK2-PB12-L00, LXK2-PB12-M00, LXK2-PB14-N00, LXK2-PB14-P00, LXK2-PB14-Q00 LXK2-PR12-L00, LXK2-PR12-M00, LXK2-PR14-Q00, LXK2-PR14-R00 LXK2-PD12-Q00, LXK2-PD12-R00, LXK2-PD12-S00 LXK2-PH12-R00, LXK2-PH12-S00 LXK2-PL12-P00, LXK2-PL12-Q00, LXK2-PL12-R00 Source: www.luxeon.com KINGBRIGHT: KA-3528ASYC Source: www.kingbright.com
D1 = Custom:B0540WS-SCHOTTKY_DIODE: Schottky barrier rectifier
J2 = Custom:SAMTEC_MUSB
J3 = Custom:JST_2MM_SMT; DIGIKEY: 455-1749-1-ND
J4 = Custom:FLEX_SERIAL_HEADER
J6 = Custom:10PIN_5X2_.050IN
J9 = Custom:DF12B-50DX_25X2_0.5MM: DF12B-50Dx 25 x 2 pin 0.5mm Stacking Header Supports both DF12B(5.0)-50DP-0.5V and DF12B-50DS-0.5V
J10 = Custom:MOLEX_527930570_5PIN_FFC_CONNECTOR: Molex 527930570 5 pin 1mm pitch FFC connector
L1 = Custom:NR3015T3R3M-INDUCTOR
L2 = Custom:NR4012T220M
L4-L6 = Custom:INDUCTOR_0603
PWR = Custom:OS102011MA1QS1
Q1 = SparkFun-DiscreteSemi:TRANSISTOR_PNP: Generic PNP BJT Double check pinouts against datasheets- not all devices are the same! MMBT3906 - 40V 200mA SOT-23 (TRANS-08052) MMBT4403 - 40V 600mA SOT-23 (TRANS-09245); PROD_ID: TRANS-09245; VALUE: MMBT4403
Q3 = Custom:FDN335N
R1-R36 = rcl:R-US_: RESISTOR, American symbol
SW1 SW3 = Custom:SMT_PUSHBUTTON: SMT Pushbutton 5.2 x 5.2 mm
TH1 = rcl:R-EU_: RESISTOR, European symbol
U1 = Custom:BQ24232H-BATTERY_CHARGER: USB-Friendly Li-ion Battery Charger and Power Path Managment IC
U2 = Custom:TPS63001-BUCK-BOOST_CONVERTER: High efficient single inductor buck-boost converter with 1.8A switches
U3 = Custom:AP5724: White LED step-up converter
U4 = Custom:AS4C8M16S-128MBIT_SDRAM: AS4C8M16S - 128Mbit SDRAM 8M x 16
U6 = Custom:AR1021-RESISTIVE_TOUCH_CONTROLLER: AR1021 - Resistive Touch Controller
U7 = lpc177x-lpc178x:LPC177X_8X-208
U8 = Custom:NUP2202: NUP2202 - 5V TVS
U$3 = HIROSE-DM3AT:DM3AT
Y1 = Custom:XTAL_2SMD_8MMX4.5MM: SMD Crystal 2-SMD 8.0 x 4.5 x 1.4mm Crystal Taken from: http://www.abracon.com/Resonators/abm2.pdf; DIGIKEY: 535-10875-1-ND